# EAGLE schematic preamp (EAGLE 9.6.2)
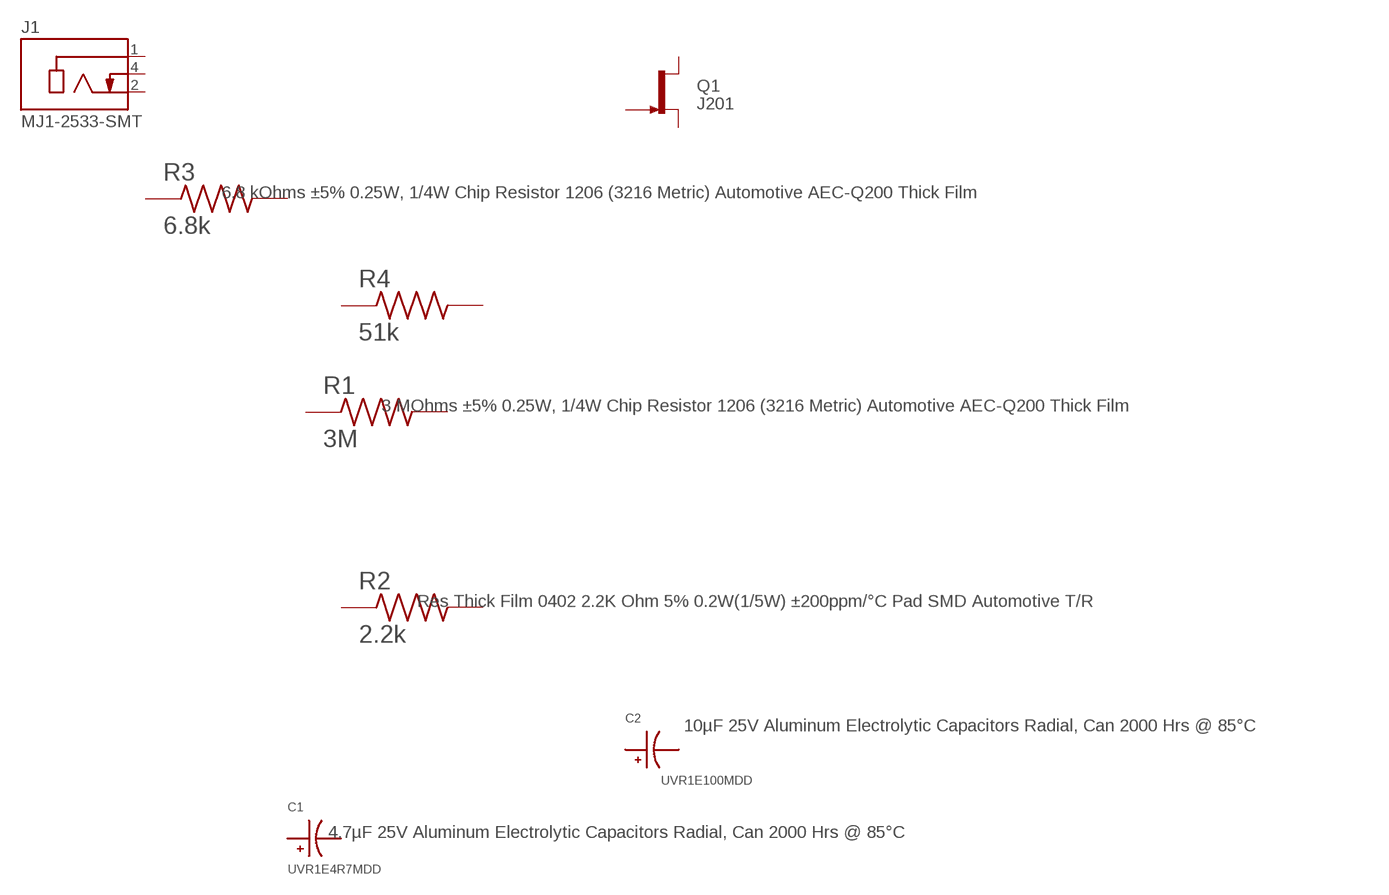
[diagram p0: schematic, sheet 1]

## Parts
C1  UVR1E4R7MDD  [CAPPRD200W50D550H1250]
C2  UVR1E100MDD  [CAPPRD200W50D550H1250]
J1  MJ1-2533-SMT  [CUI_MJ1-2533-SMT]
Q1  J201  [TO92-]
R1  3M  CRCW12063M00JNEA  [RESC3116X60N]
R2  2.2k  CRCW04022K20JNEDHP  [RESC1005X40N]
R3  6.8k  CRCW12066K80JNEA  [RESC3116X60N]
R4  51k  CRCW120651K0JNEA  [RESC3116X60N]
Unconnected: C1.1 C1.2 C2.1 C2.2 J1.1 J1.2 J1.4 Q1.1(G) Q1.2(S) Q1.3(D) R1.1 R1.2 R2.1 R2.2 R3.1 R3.2 R4.1 R4.2

## Library data of the parts
C1 = UVR1E4R7MDD:UVR1E4R7MDD: 0.47µF 100V Aluminum Electrolytic Capacitors Radial, Can 2000 Hrs @ 85°C Check prices <https://pricing.snapeda.com/parts/UVR1E4R7MDD/Nichicon/view-part?ref=eda>; AVAILABILITY: Good; DESCRIPTION: 4.7µF 25V Aluminum Electrolytic Capacitors Radial, Can 2000 Hrs @ 85°C; MF: Nichicon; MP: UVR1E4R7MDD; PACKAGE: Radial Nichicon; PRICE: None; PURCHASE-URL: https://pricing.snapeda.com/search/part/UVR1E4R7MDD/?ref=eda
C2 = UVR1E100MDD:UVR1E100MDD: 0.47µF 100V Aluminum Electrolytic Capacitors Radial, Can 2000 Hrs @ 85°C Check prices <https://pricing.snapeda.com/parts/UVR1E100MDD/Nichicon/view-part?ref=eda>; AVAILABILITY: Good; DESCRIPTION: 10µF 25V Aluminum Electrolytic Capacitors Radial, Can 2000 Hrs @ 85°C; MF: Nichicon; MP: UVR1E100MDD; PACKAGE: Radial Nichicon; PRICE: None; PURCHASE-URL: https://pricing.snapeda.com/search/part/UVR1E100MDD/?ref=eda
J1 = MJ1-2533-SMT:MJ1-2533-SMT: 2.5 mm, Mono, Right Angle, Surface Mount (SMT), Audio Jack Connector; DESCRIPTION: 2.50mm (0.094, 3/32, Sub Mini, Miniature) - Headphone Phone Jack Mono Connector Solder; DIGI-KEY_PART_NUMBER: CP1-2533MJCT-ND; MF: CUI Devices; MP: MJ1-2533-SMT; PACKAGE: None
Q1 = J201:J201: N-channel JFET Check prices <https://pricing.snapeda.com/parts/J201/ON%20Semiconductor/view-part?ref=eda>; AVAILABILITY: Warning; DESCRIPTION: JFET N-Channel 40V 350mW Surface Mount SOT-23-3; MF: ON Semiconductor; MP: J201; PACKAGE: E-PKG AXIAL-LEADED-2 ON Semiconductor; PRICE: None; PURCHASE-URL: https://pricing.snapeda.com/search/part/J201/?ref=eda
R1 = CRCW12063M00JNEA:CRCW12063M00JNEA: RES SMD 3M OHM 5% 1/4W 1206 Check prices <https://pricing.snapeda.com/parts/CRCW12063M00JNEA/Vishay%20Dale/view-part?ref=eda>; AVAILABILITY: Good; DESCRIPTION: 3 MOhms ±5% 0.25W, 1/4W Chip Resistor 1206 (3216 Metric) Automotive AEC-Q200 Thick Film; MF: Vishay Dale; MP: CRCW12063M00JNEA; PACKAGE: 3116 Vishay; PRICE: None; PURCHASE-URL: https://pricing.snapeda.com/search/part/CRCW12063M00JNEA/?ref=eda
R2 = CRCW04022K20JNEDHP:CRCW04022K20JNEDHP: Check prices <https://pricing.snapeda.com/parts/CRCW04022K20JNEDHP/Vishay/view-part?ref=eda>; AVAILABILITY: Warning; DESCRIPTION: Res Thick Film 0402 2.2K Ohm 5% 0.2W(1/5W) ±200ppm/°C Pad SMD Automotive T/R; MF: Vishay; MP: CRCW04022K20JNEDHP; PACKAGE: 1005 Panasonic Electronic Components; PRICE: None; PURCHASE-URL: https://pricing.snapeda.com/search/part/CRCW04022K20JNEDHP/?ref=eda
R3 = CRCW12066K80JNEA:CRCW12066K80JNEA: RES, THICK FILM, 6K8, 5%, 0.25W, 1206 Check prices <https://pricing.snapeda.com/parts/CRCW12066K80JNEA/Vishay%20Dale/view-part?ref=eda>; AVAILABILITY: Good; DESCRIPTION: 6.8 kOhms ±5% 0.25W, 1/4W Chip Resistor 1206 (3216 Metric) Automotive AEC-Q200 Thick Film; MF: Vishay Dale; MP: CRCW12066K80JNEA; PACKAGE: 3116 Vishay; PRICE: None; PURCHASE-URL: https://pricing.snapeda.com/search/part/CRCW12066K80JNEA/?ref=eda
R4 = CRCW120651K0JNEA:CRCW120651K0JNEA: Res Thick Film 1206 51K Ohm 5% 0.25W(1/4W) ±200ppm/C Molded SMD Automotive Paper T/R Check prices <https://pricing.snapeda.com/parts/CRCW120651K0JNEA/Vishay%20Dale/view-part?ref=eda>; AVAILABILITY: Good; DESCRIPTION: Res Thick Film 1206 51K Ohm 5% 0.25W(1/4W) ±200ppm/C Molded SMD Automotive Paper T/R; MF: Vishay Dale; MP: CRCW120651K0JNEA; PACKAGE: 3116 Vishay; PRICE: None; PURCHASE-URL: https://pricing.snapeda.com/search/part/CRCW120651K0JNEA/?ref=eda